# Altium schematic sheet Ref.02_DDR_Memory_1.SchDoc
size A2; SheetNumber: 10; SheetTotal: 11
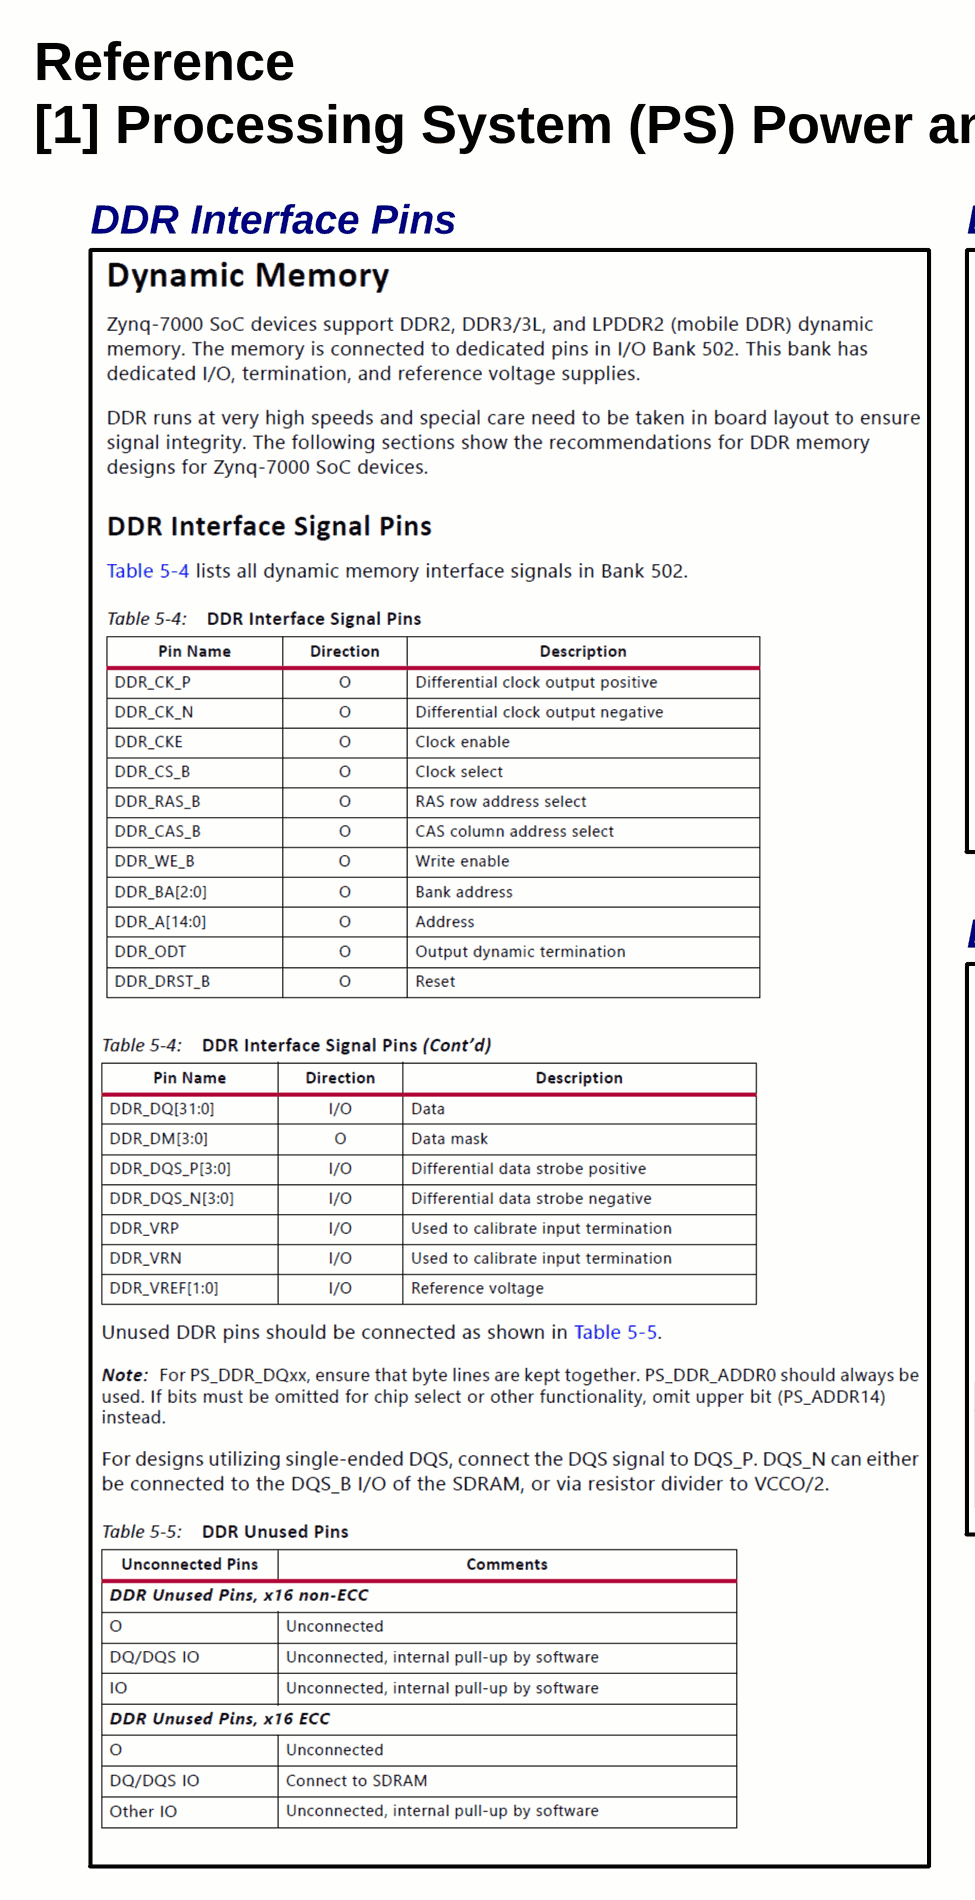
[diagram p0: Ref.02_DDR_Memory_1.SchDoc, left]
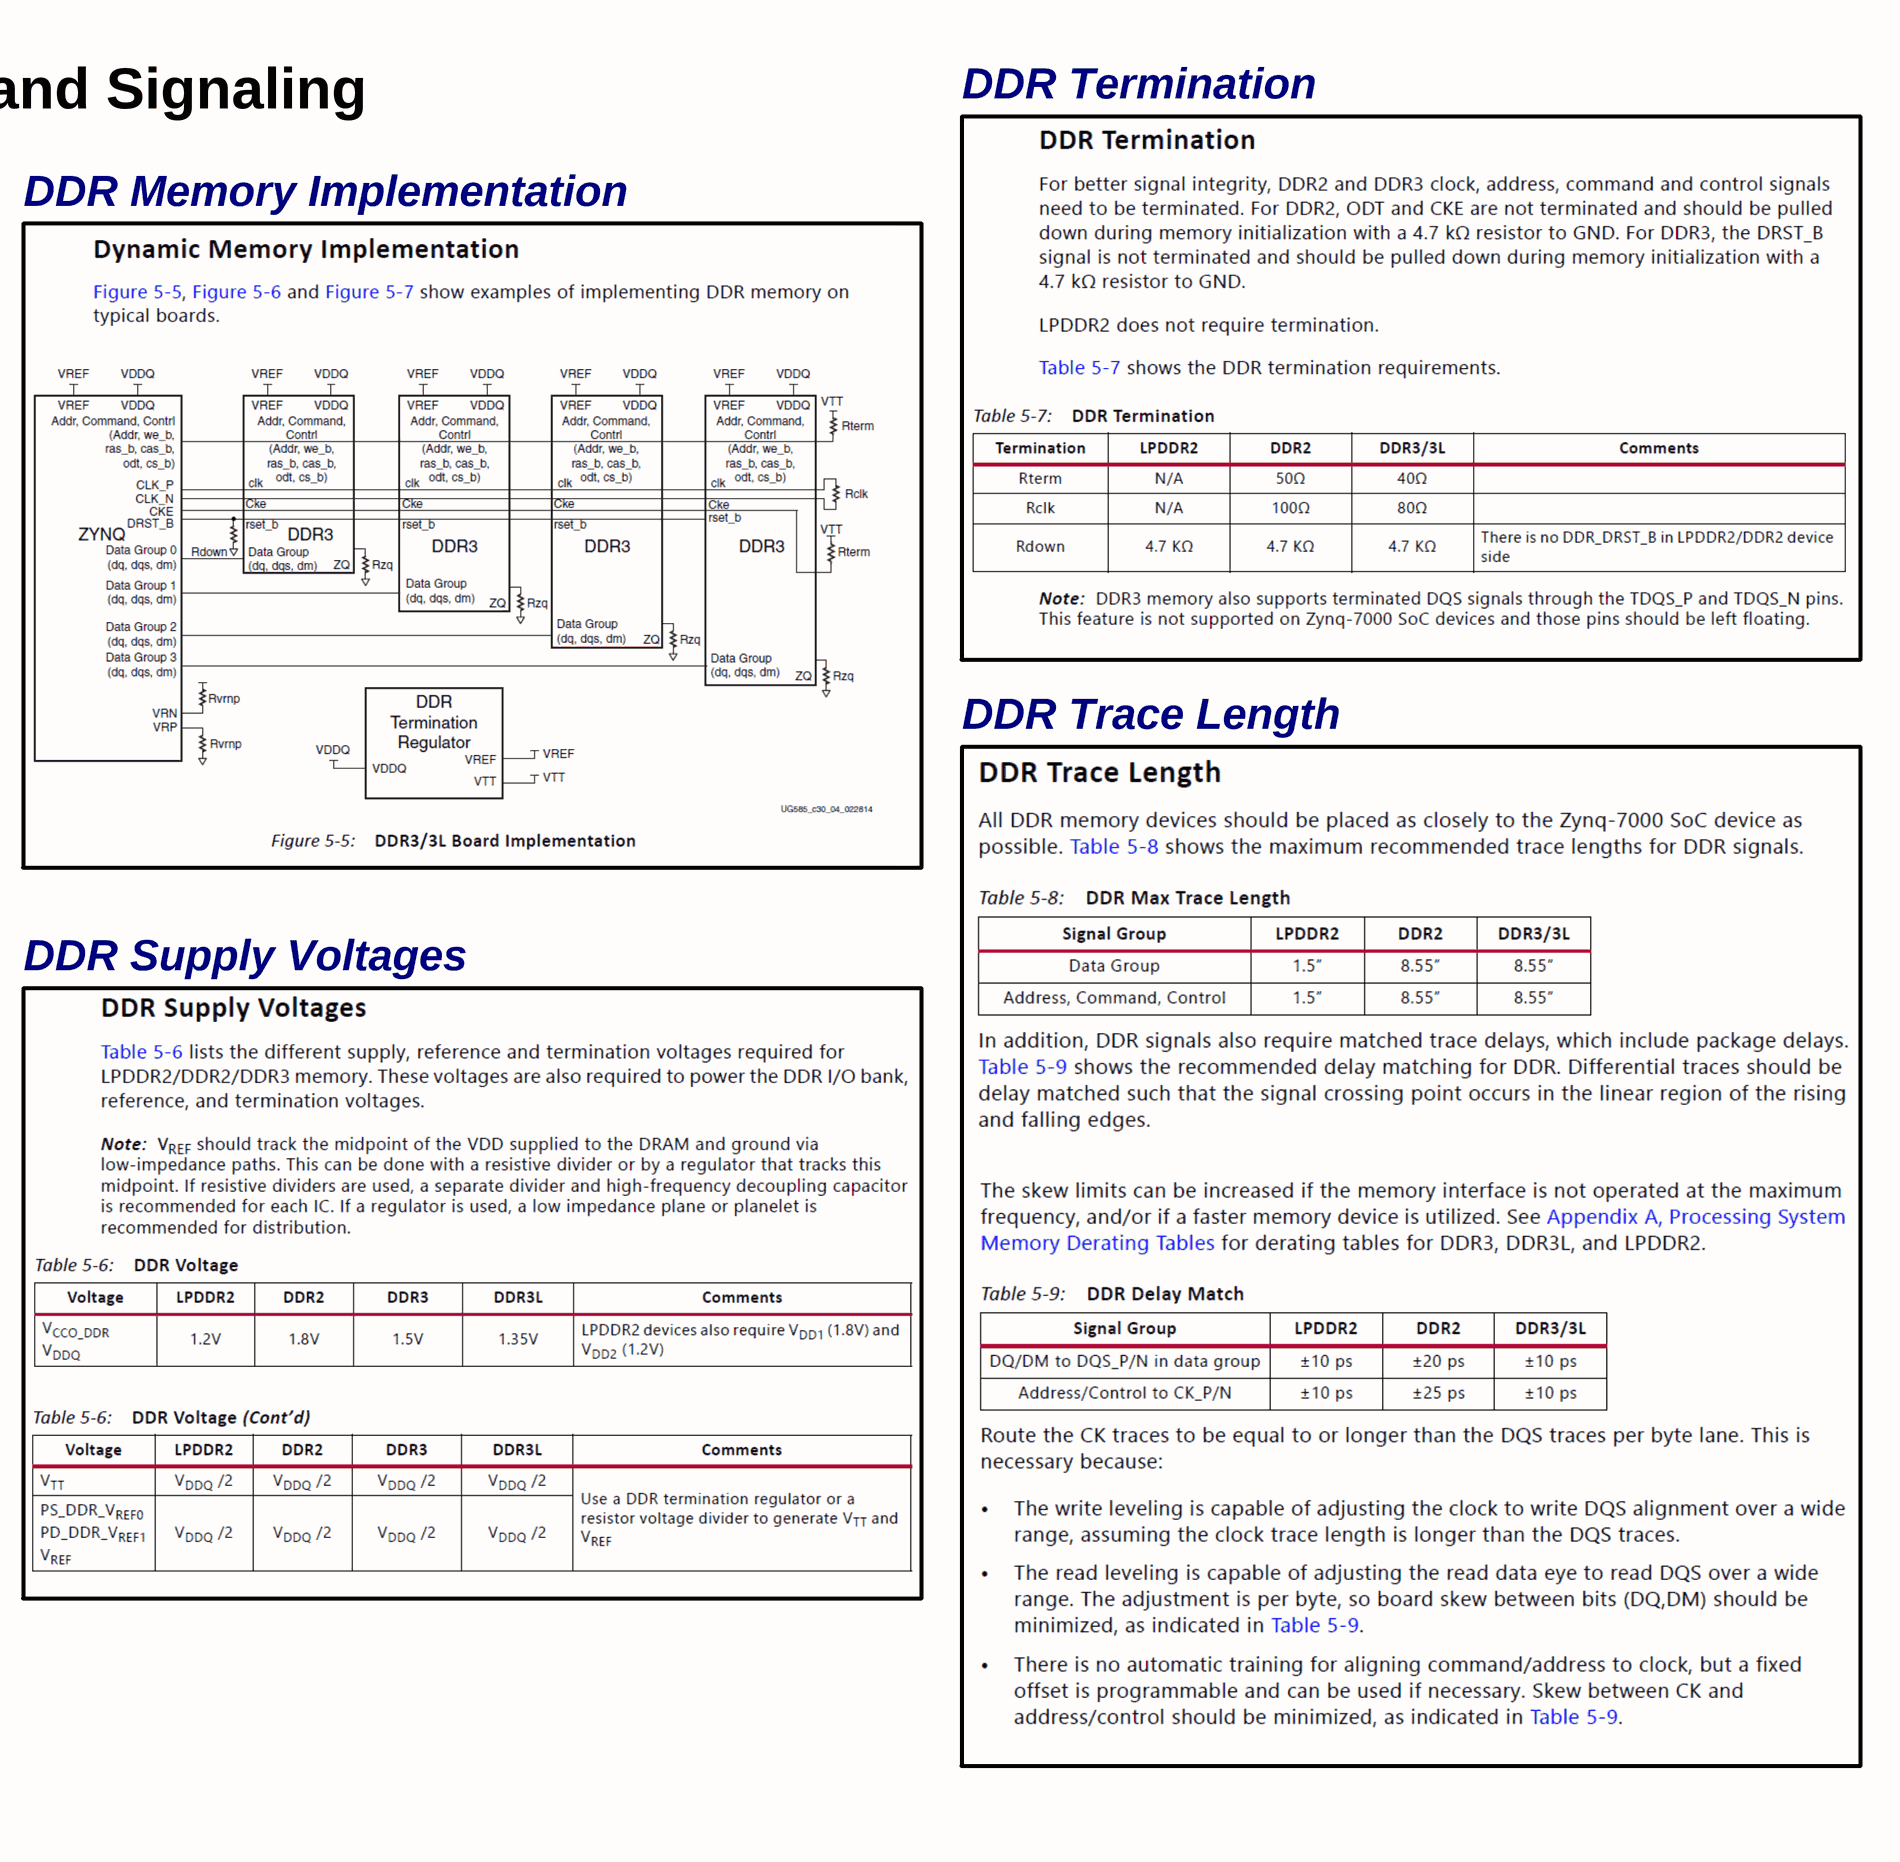
[diagram p1: Ref.02_DDR_Memory_1.SchDoc, right]

## Notes on the sheet
- Reference
- DDR Termination
- [1] Processing System (PS) Power and Signaling
- DDR Interface Pins
- DDR Memory Implementation
- DDR Trace Length
- DDR Supply Voltages
- Title
- Rev
- Doc
- Sheet #
- of
- Author
- This document is copyright of ArkX and shall not be revealed, produced, copied, in whole or in part,
- Date
- nor used for any purpose other than submitted.